# EAGLE design AutoProgramFTDI (EAGLE 9.2.0)
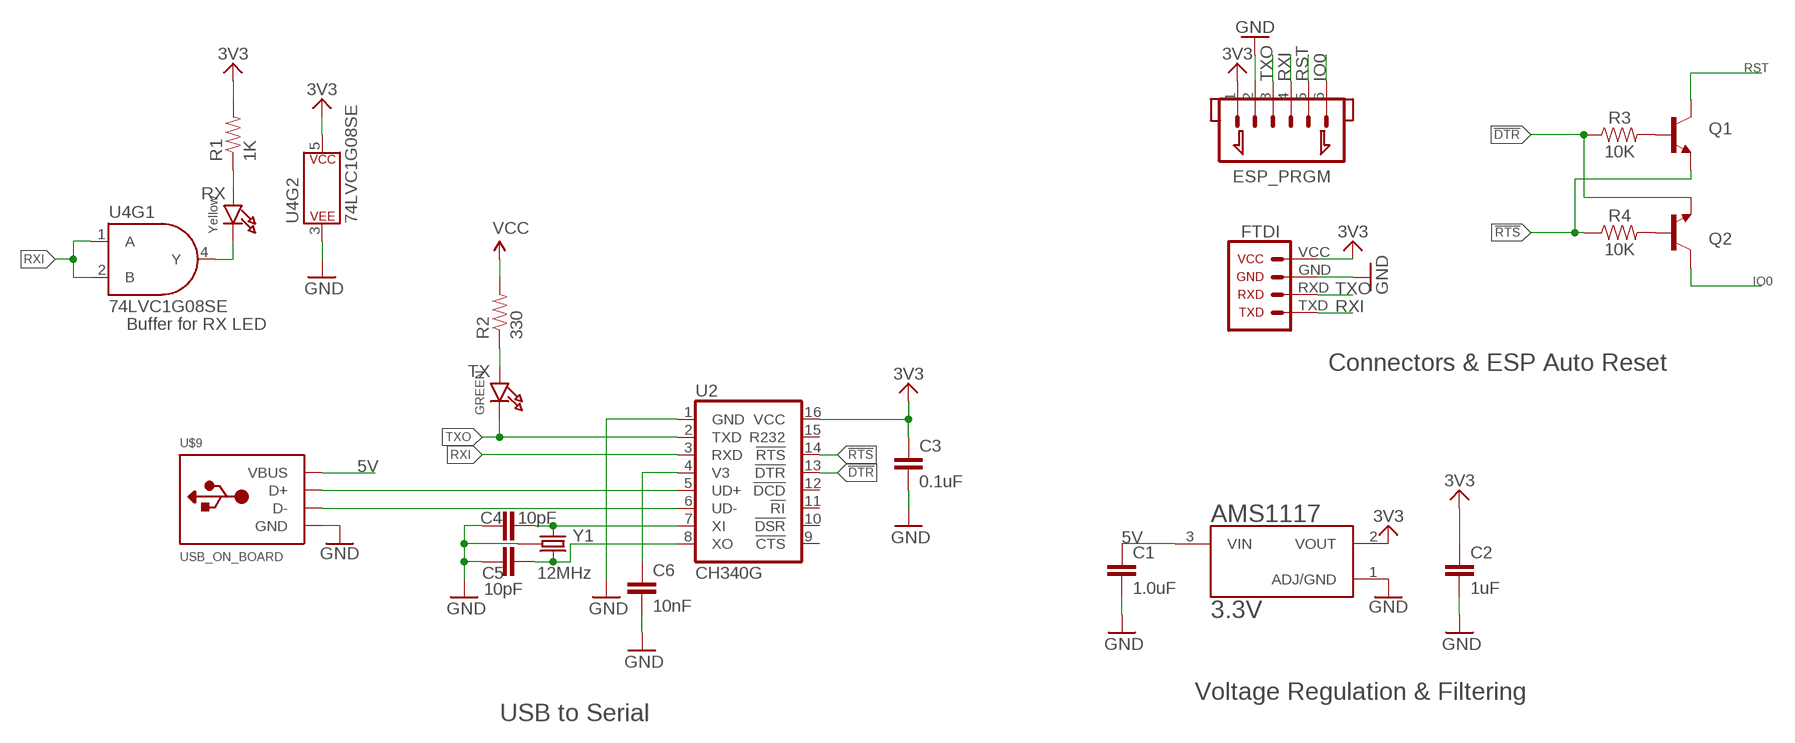
[diagram p0: schematic, sheet 1]

## Parts
AMS1117  3.3V  VREG_AMS1117  [SOT229P700X180-4N]
C1  1.0uF  1.0UF-16V-10%(0603)  [0603-CAP]
C2  1uF  1.0UF-16V-10%(0603)  [0603-CAP]
C3  0.1uF  0.1UF-25V(+80/-20%)(0603)  [0603-CAP]
C4  10pF  10PF-50V-5%(0603)  [0603-CAP]
C5  10pF  10PF-50V-5%(0603)  [0603-CAP]
C6  10nF  10NF/10000PF-50V-10%(0603)  [0603-CAP]
ESP_PRGM  JST_1.25_6P  [JST1.25_6P]
Q1  TRANSISTOR_NPNSOT23-3  [SPARKFUN_SOT23-3]
Q2  TRANSISTOR_NPNSOT23-3  [SPARKFUN_SOT23-3]
R1  1K  RESISTOR0603  [0603]
R2  330  RESISTOR0603  [0603]
R3  10K  RESISTOR0603  [0603]
R4  10K  RESISTOR0603  [0603]
RX  Yellow  LED0603  [MICROBUILDER_CHIPLED_0603]
TX  GREEN  LED0603  [MICROBUILDER_CHIPLED_0603]
U2  CH340G  FTDI_CH340GSMD  [SO016]
U4  74LVC1G08SE  GATE_7408  [SOT353]
U$6  FTDI  [1X06]
U$9  USB_ON_BOARD  [USB_ON_BOARD]
Y1  12MHz  CRYSTAL-GROUNDED3.2X2.5  [CRYSTAL-SMD-3.2X2.5]

## Nets
3.3V [power]: AMS1117.2(VOUT) C2.1 C3.1 ESP_PRGM.1 R1.2 U2.16(VCC) U4.5(P$V+) U$6.VCC ; supply symbol labelled SUPPLY_3.3V
5V: AMS1117.3(VIN) C1.1 U$9.VCC(VBUS)
!DTR: Q2.2(E) R3.1 U2.13(!DTR)
!RTS: Q1.2(E) R4.1 U2.14(!RTS)
GND [power]: AMS1117.1(ADJ/GND) C1.2 C2.2 C3.2 C4.1 C5.1 C6.2 ESP_PRGM.2 U2.1(GND) U4.3(P$V-) U$6.GND U$9.GND Y1.2(GND) Y1.4(GND) ; supply symbol labelled SUPPLY_GND
IO0: ESP_PRGM.6 Q2.3(C)
N$1: R2.1 TX.A
N$2: R1.1 RX.A
N$3: C5.2 U2.8(XO) Y1.3
N$4: C4.2 U2.7(XI) Y1.1
N$5: RX.C U4.4(Y)
N$6: U2.6(UD-) U$9.D-
N$7: U2.5(UD+) U$9.D+
N$8: Q1.1(B) R3.2
N$9: Q2.1(B) R4.2
RST: ESP_PRGM.5 Q1.3(C)
RXI: ESP_PRGM.4 U2.3(RXD) U4.1(A) U4.2(B) U$6.TXD
TXO: ESP_PRGM.3 TX.C U2.2(TXD) U$6.RXD
V3: C6.1 U2.4(V3)
VCC: R2.2
Unconnected: U2.9(!CTS) U2.10(!DSR) U2.11(!RI) U2.12(!DCD) U2.15(R232)

## Notes on the sheet
- Buffer for RX LED
- Connectors & ESP Auto Reset
- Voltage Regulation & Filtering
- USB to Serial

## Library data of the parts
AMS1117 = Scott-ICs:VREG_AMS1117: Sot223/Pkg 1-Amp 3.3-Volt Low Drop Out Voltage Regulatator; AVAILABILITY: Unavailable; DESCRIPTION: Sot223/Pkg 1-Amp 3.3-Volt Low Drop Out Voltage Regulatator; MF: Advanced Monolithic Systems; MP: AMS1117-3.3; PACKAGE: None; PRICE: None
C1 = SparkFun-Capacitors:1.0UF-16V-10%(0603): CAP-00868; PROD_ID: CAP-00868
C2 = SparkFun-Capacitors:1.0UF-16V-10%(0603): CAP-00868; PROD_ID: CAP-00868; VALUE: 1.0uF
C3 = SparkFun-Capacitors:0.1UF-25V(+80/-20%)(0603): CAP-00810 Ceramic Standard decoupling cap; PROD_ID: CAP-00810
C4 C5 = SparkFun-Capacitors:10PF-50V-5%(0603): CAP-11812; PROD_ID: CAP-11812
C6 = SparkFun-Capacitors:10NF/10000PF-50V-10%(0603): CAP-00867; PROD_ID: CAP-00867
ESP_PRGM = Scott-Connectors:JST_1.25_6P
Q1 Q2 = Scott-Electrical:TRANSISTOR_NPN: Transistor NPN BJT configuration in SOT23 package. MMBT2222 is the common NPN we use. Double check BCE configuration again layout.
R1-R4 = Scott-Electrical:RESISTOR: Generic Resistor Package
RX TX = Scott-Electrical:LED: LED 0603 - 0603 Surface Mount Package 2mA: Green LED - Low Power (3.9mcd, 2ma, 1.7Vf) - Digikey: 475-2709-2-ND Orange LED - Low Power (9.8mcd, 2ma, 1.8Vf) - Digikey: 475-1194-2-ND Red LED - Low Power (5mcd, 2ma, 1.8Vf) - Digikey: 475-1195-2-ND Yellow LED - Low Power (7mcd, 2ma, 1.8Vf) - Digikey: 475-1196-2-ND 5mA: Blue LED - Low Power (17mcd, 5ma, 2.9Vf) - Digikey: LNJ937W8CRACT-ND 0805 - 0805 Surface Mount Package 2mA: Red LED (8.8mcd, 2mA, 1.8Vf, Clear) - Low Power [Digikey: 475-2510-1-ND] Green LED (5mcd, 2mA, 1.8Vf, Clear) - Low Power [Digikey: 475-2730-1-ND] Yellow LED (11.3mcd, 2mA, 1.8Vf, Clear) - Low Power [Digikey: 475-2555-1-ND] 20mA: Red LED (104mcd, 20mA, Diffused) - LS R976 [Digikey: 475-1278-6-ND] Red LED (12mcd, 20mA, 2.0Vf, Clear) - APT2012EC [Digikey: 754-1128-1-ND] Green LED (15mcd, 20mA, 2.2Vf, Clear) - APT2012GC [Digikey: 754-1131-1-ND] Orange LED (160mcd, 20mA, 2.1Vf, Clear) - APT2012SECK [Digikey: 754-1130-1-ND] 1206 - 1206 Surface Mount Package Green LED (26mcd, 20mA, Diffused) - LG N971 [Digikey: 475-1407-6-ND] Red LED (15mcd, 20mA, Diffused) - LH N974 [Digikey: 475-1416-6-ND] Cree - Cree High-Power Surface Mount LEDs XPEBWT-L1-0000-00D50 - White 111lm 350mA 2.9Vf 6200K 110° XTEAWT-00-0000-00000LEE3 - White 114lm 350mA 2.85Vf 5000K 115° Everlight - Everlight 45-21 Series Surface Mount LEDs 45-21/QK2C-B2832AC2CB2/2T - Warm White 2000mcd 20mA 3.25Vf 3050K 120° 45-21/LK2C-B38452C4CB2/2T - Nuetral White 2000mcd 20mA 3.25Vf 4150K 120° 45-21/LK2C-B50634C6CB2/2T - Cold White 2200mcd 20mA 3.25Vf 5650K 120° PLCC2 Reverse Mount LS T77K-J1L2-1-0-2-R18-Z - Red 11.25mcd 2mA 1.8Vf 630nm 120° LO T77K-L1M2-24-Z - Orange 19.6mcd 2mA 1.8Vf 606nm 120° LY T77K-K2M1-26-Z - Yellow 15.7mcd 2mA 1.8Vf 587nm 120°
U2 = Scott-ICs:FTDI_CH340G: A simple USB 2.0 to Serial IC.; PROD_ID: IC-13498
U4 = Scott-ICs:GATE_74*08: Single AND gate IC GATE AND SNGL 2INPUT SOT353 SparkFun Products SparkFun LogicBlocks Kit <https://www.sparkfun.com/products/11006> (KIT-11006) SparkFun RedBot Mainboard <https://www.sparkfun.com/products/12097> (ROB-12097); PROD_ID: IC-10841
U$6 = Scott-Connectors:FTDI
U$9 = Scott-Connectors:USB_ON_BOARD
Y1 = Scott-ICs:CRYSTAL-GROUNDED: Small, 3.2x2.5mm, SMD Crystal; PROD_ID: XTAL-13518

## Net classes
1 power: width 0.178 mm

## Board
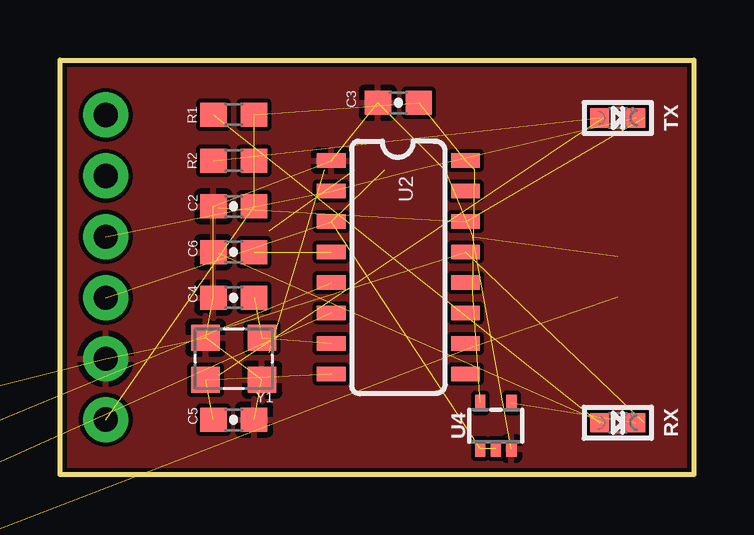
[diagram p1: board, top side]
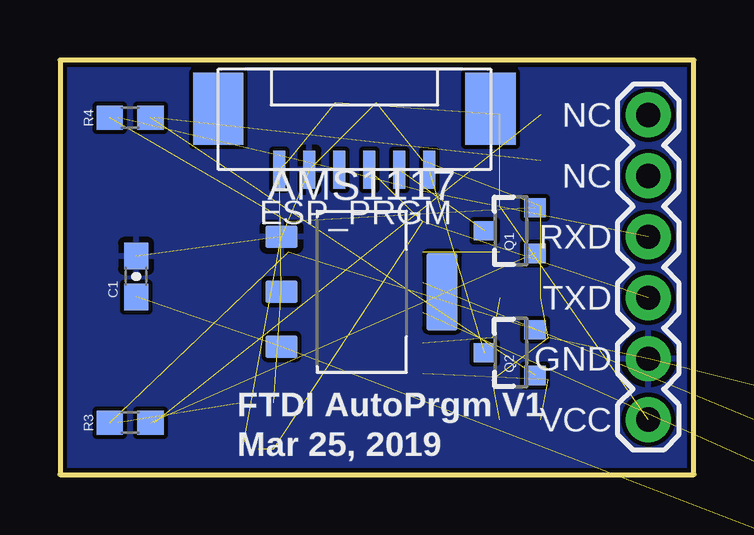
[diagram p2: board, bottom side, seen from below]

Size 26.42 x 17.27 mm. Coordinates in mm from the lower left corner, seen from the top.
Outline: 0,17.27 26.42,17.27 26.42,0 0,0 0,17.27
Copper layers (1*16): Top 0.035mm / dielectric 1.5mm / Bottom 0.035mm
Design rules "SparkFun-2-layer-TIGHT *": minimum track width 7mil, minimum drill 15mil, track to track 7mil, track to pad 7mil, pad to pad 7mil, via to via 7mil, smd to smd 7mil, copper to edge 7mil, drill to drill 7mil, minimum pad ring 7mil, minimum via ring 7mil, stop-mask expansion 4mil, vias tented up to drill 20mil, thermal gap 10mil

### Footprints (pad centres in the part's own frame; a part is rotated, then mirrored left to right if it is on the bottom)
SOT229P700X180-4N = smd 0.93 x 1.31: 1 -2.29,-3.345; 2 0,-3.345; 3 2.29,-3.345 | smd 3.24 x 1.31: 4 0,3.345
0603-CAP = smd 1.1 x 1: 1 -0.85,0; 2 0.85,0
JST1.25_6P = smd 0.5 x 1.6: 1 0,0; 2 1.25,0; 3 2.5,0; 4 3.75,0; 5 5,0; 6 6.25,0 | smd 2.1 x 3: 7 -2.55,2.55; 8 8.8,2.55
SPARKFUN_SOT23-3 = smd 0.8 x 0.9: 1 -0.95,-1; 2 0.95,-1; 3 0,1.1
0603 = smd 1.1 x 1: 1 -0.85,0; 2 0.85,0
MICROBUILDER_CHIPLED_0603 = smd 0.8 x 0.8: A 0,-0.75; C 0,0.75
SO016 = smd 0.6 x 1.2: 1 -4.445,-2.8; 2 -3.175,-2.8; 3 -1.905,-2.8; 4 -0.635,-2.8; 5 0.635,-2.8; 6 1.905,-2.8; 7 3.175,-2.8; 8 4.445,-2.8; 9 4.445,2.8; 10 3.175,2.8; 11 1.905,2.8; 12 0.635,2.8; 13 -0.635,2.8; 14 -1.905,2.8; 15 -3.175,2.8; 16 -4.445,2.8
SOT353 = smd 0.42 x 0.7: 1 -0.65,-0.95; 2 0,-0.95; 3 0.65,-0.95; 4 0.65,0.95; 5 -0.65,0.95
1X06 = drill 1.016 pad 1.88: GND 0,1.27; NC@1 0,-6.35; NC@2 0,-8.89; RXD 0,-3.81; TXD 0,-1.27; VCC 0,3.81
USB_ON_BOARD = smd 6.41 x 1: D+ 0,1; D- 0,-1 | smd 7.41 x 1: GND -0.5,3.5; VCC -0.5,-3.5
CRYSTAL-SMD-3.2X2.5 = smd 1.2 x 1.1: 1 -1.175,-0.875; 2 1.175,-0.875; 3 1.175,0.875; 4 -1.175,0.875

### Placement (x,y rotation side)
AMS1117  13.84,7.62 270 bottom
C1  23.24,8.26 90 bottom
C2  7.24,11.18 180 top
C3  14.1,15.49 180 top
C4  7.24,7.37 0 top
C5  7.24,2.29 180 top
C6  7.24,9.27 180 top
ESP_PRGM  17.27,12.7 0 bottom
Q1  7.62,10.16 90 bottom
Q2  7.62,5.08 90 bottom
R1  7.24,14.99 0 top
R2  7.24,13.08 0 top
R3  23.5,2.16 0 bottom
R4  23.5,14.86 0 bottom
RX  23.24,2.16 270 top
TX  23.24,14.86 270 top
U2  14.1,8.64 270 top
U4  18.16,2.03 0 top
U$6  1.91,6.1 180 bottom
U$9  -9.91,-1.78 0 top  (outside the outline)
Y1  7.24,4.83 180 top

### Tracks (layer width: path | path; a pad name or v marks a point on that pad's centre or on a via)
3.3V  (7 unrouted)
5V  (2 unrouted)
!DTR  (2 unrouted)
!RTS  (2 unrouted)
GND  (13 unrouted)
  pour Top: 0,17.27 26.42,17.27 26.42,0 0,0
  pour Bottom: 0,17.27 26.42,17.27 26.42,0 0,0
IO0  (1 unrouted)
N$1  (1 unrouted)
N$2  (1 unrouted)
N$3  (2 unrouted)
N$4  (2 unrouted)
N$5  (1 unrouted)
N$6  (1 unrouted)
N$7  (1 unrouted)
N$8  (1 unrouted)
N$9  (1 unrouted)
RST  (1 unrouted)
RXI  (4 unrouted)
TXO  (3 unrouted)
V3  (1 unrouted)

### Text on the board
bPlace: FTDI AutoPrgm V1 | Mar 25, 2019
Measures: All dimensions in inches